# Altium schematic sheet isoDebug.SchDoc
size A4; Organization: UltraZohm; SheetNumber: 31; SheetTotal: 40
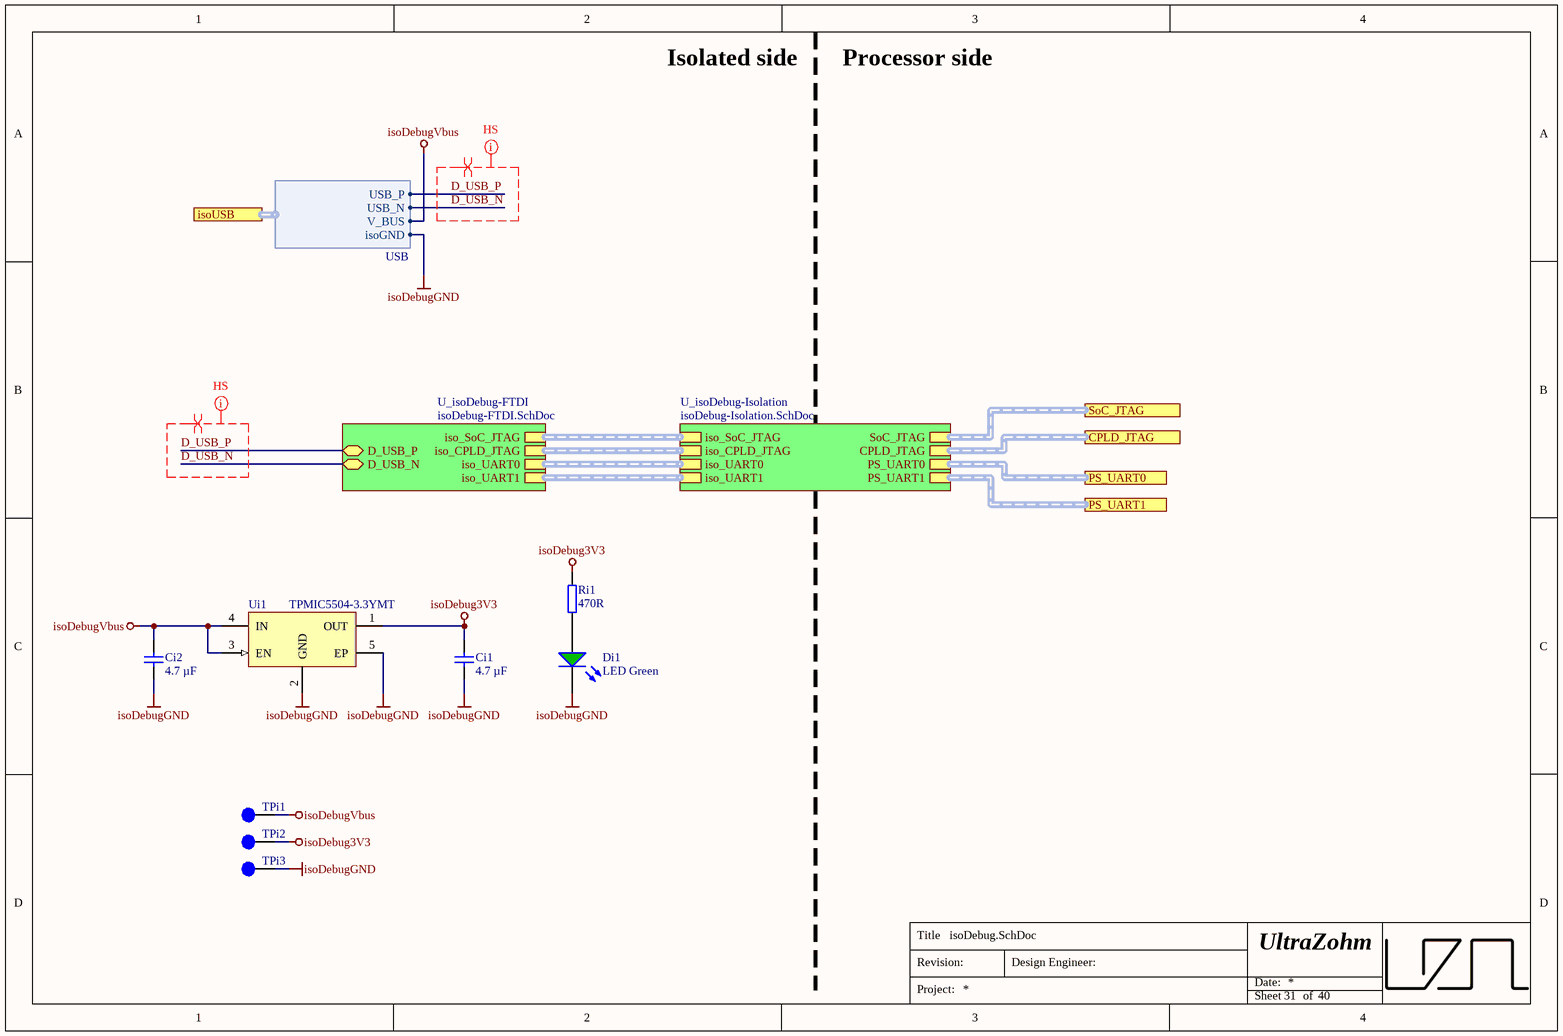
[diagram p0: isoDebug.SchDoc]

## Parts
Ci1  4.7 µF  [C_0603_TE]
Ci2  4.7 µF  [C_0603_TE]
Di1  LED Green  [WL-SMCW_0603]
Ri1  470R  [R_0603_TE]
TPi1  Testpoint 1mm  [TP_1mm]  (value not drawn)  (no BOM)
TPi2  Testpoint 1mm  [TP_1mm]  (value not drawn)  (no BOM)
TPi3  Testpoint 1mm  [TP_1mm]  (value not drawn)  (no BOM)
Ui1  TPMIC5504-3.3YMT  [DFN-4-EP]

## Sub-sheets
U_isoDebug-FTDI = isoDebug-FTDI.SchDoc: iso_SoC_JTAG (harness JTAG), iso_CPLD_JTAG (harness JTAG), iso_UART0 (harness UART), iso_UART1 (harness UART), D_USB_P (bidir), D_USB_N (bidir)
U_isoDebug-Isolation = isoDebug-Isolation.SchDoc: iso_SoC_JTAG (harness JTAG), iso_CPLD_JTAG (harness JTAG), iso_UART0 (harness UART), iso_UART1 (harness UART), SoC_JTAG (harness JTAG), CPLD_JTAG (harness JTAG), PS_UART0 (harness UART), PS_UART1 (harness UART)

## Ports
CPLD_JTAG (harness JTAG), isoUSB (harness USB), PS_UART0 (harness UART), PS_UART1 (harness UART), SoC_JTAG (harness JTAG)

## Harnesses
USB: USB_P, USB_N, V_BUS, isoGND

## Nets
isoDebug3V3: Ci1.2 Ri1.2 TPi2.1 Ui1.1(OUT)
isoDebugGND: Ci1.1 Ci2.1 Di1.1(K) TPi3.1 Ui1.2(GND) Ui1.5(EP) ; port isoUSB.isoGND
isoDebugVbus: Ci2.2 TPi1.1 Ui1.3(EN) Ui1.4(IN) ; port isoUSB.V_BUS
D_USB_N: sheet U_isoDebug-FTDI/D_USB_N, port isoUSB.USB_N
D_USB_P: sheet U_isoDebug-FTDI/D_USB_P, port isoUSB.USB_P
NetDi1_2: Di1.2(A) Ri1.1

## Buses and harness runs
harness port CPLD_JTAG = sheet U_isoDebug-Isolation/CPLD_JTAG
harness port PS_UART0 = sheet U_isoDebug-Isolation/PS_UART0
harness port PS_UART1 = sheet U_isoDebug-Isolation/PS_UART1
harness port SoC_JTAG = sheet U_isoDebug-Isolation/SoC_JTAG
harness sheet U_isoDebug-FTDI/iso_CPLD_JTAG = sheet U_isoDebug-Isolation/iso_CPLD_JTAG
harness sheet U_isoDebug-FTDI/iso_SoC_JTAG = sheet U_isoDebug-Isolation/iso_SoC_JTAG
harness sheet U_isoDebug-FTDI/iso_UART0 = sheet U_isoDebug-Isolation/iso_UART0
harness sheet U_isoDebug-FTDI/iso_UART1 = sheet U_isoDebug-Isolation/iso_UART1

## Layout directives
differential pair: D_USB_N, D_USB_P
net class HS: D_USB_N, D_USB_P

## Notes on the sheet
- Isolated side
- Processor side
- Title
- Revision:
- Design Engineer:
- Date:
- Project:
- Sheet
- of

## Library data of the parts
Ci1 Ci2 = UZgen_C_0603_4.7uF_16V_X5R: Generic capacitor; Manufacturer: UZgen; Tolerance: 10 %; Created from: MGeier; Voltage: 16V; Manufacturer Part Number: UZgen_C_0603_4.7uF_16V_X5R; PartID: 5809; Created On: 20/03/2025 14:43:45; Device Package: 0603; Last Updated: 20/03/2025 14:43:45; Mounting Type: SMD; Value: 4.7 µF; Technology: X5R
Di1 = UZgen_LED_0603_Green: Standard LEDs - SMD 0603 green; Manufacturer: UZgen; Created from: UZgenTool; Manufacturer Part Number: UZgen_LED_0603_Green; PartID: 21; Created On: 09/09/2024 10:45:01; ComponentLink1Description: N/A; ComponentLink1URL: N/A; Component Type: LED Diode; Device Package: 0603; Last Updated: 09/09/2024 10:45:01; Mounting Type: SMD; Supplier 1: LCSC; Supplier Part Number 1: =LCSC Part Number; Type: Standard; Live Cycle Status: 1; Stock number: not stored; Color: green; Value: LED Green
Ri1 = UZgen_R_0603_470R: Generic resistor; Manufacturer: UZgen; Tolerance: 1 %; Created from: UZgenTool; Manufacturer Part Number: UZgen_R_0603_470R; PartID: 213; Created On: 02/07/2024 17:29:49; Device Package: 0603; Last Updated: 02/07/2024 17:29:49; Mounting Type: SMD; Value: 470R
TPi1-TPi3 = NULL: Manufacturer Part Number: NULL; Created from: AGeiger; Created: 2018_06_25_AGeiger; Value: Testpoint 1mm; PartID: 9; Created On: 20.09.2022 13:14:57; Component Type: Testpoint; Last Updated: 20.09.2022 13:15:39; Manufacturer: NULL; Supplier 1: NULL; Supplier Part Number 1: NULL; Type: Testpoint; Live Cycle Status: 1
Ui1 = TPMIC5504-3.3YMT: DFN-4-EP(1x1) Linear Voltage Regulators (LDO) ROHS; Manufacturer: TECH PUBLIC; Value: 3.3 V; Created from: AGeiger; Manufacturer Part Number: TPMIC5504-3.3YMT; PartID: 15; Created On: 26.11.2023 13:32:42; ComponentLink1Description: Datasheet; ComponentLink1URL: https://datasheet.lcsc.com/lcsc/2205241716_TECH-PUBLIC-TPMIC5504-3-3YMT_C3021135.pdf; Component Type: LDO; Device Package: SMD; Last Updated: 26.11.2023 13:32:42; Mounting Type: SMD; Operating Temperature: -40 to 125 °C; Series: TPMIC5504; Supplier 1: LCSC; Supplier Part Number 1: C3021135; Type: LDO; Live Cycle Status: 1; LCSC Part Number: C3021135; Stock number: not stored